# Altium schematic sheet reset.SchDoc
size A4
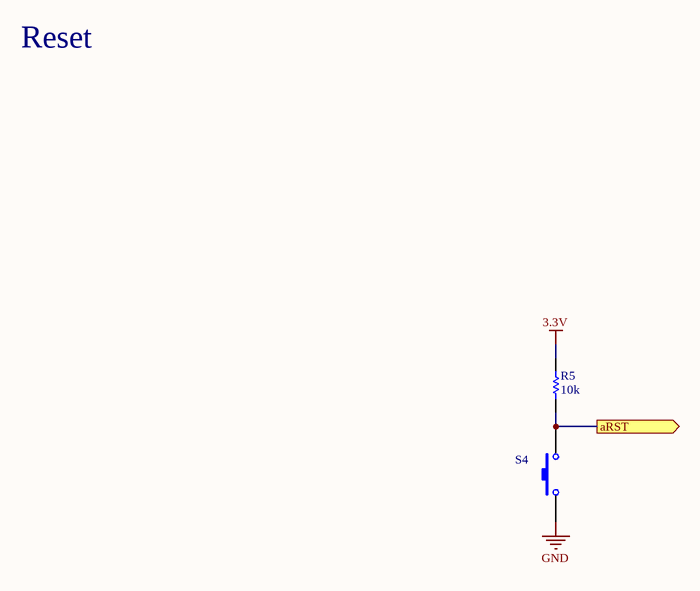
[diagram p0: reset.SchDoc]

## Parts
R5  10k  [AXIAL-0.3]
S4  Switch  [SPST-2]  (value not drawn)

## Ports
aRST (out)

## Nets
3.3V: R5.2
GND: S4.1
aRST: R5.1 S4.2 ; port aRST

## Notes on the sheet
- Reset

## Library data of the parts
R5 = Res1: Resistor; Published: 8-Jun-2000; LatestRevisionDate: 17-Jul-2002; LatestRevisionNote: Re-released for DXP Platform.; PackageReference: AXIAL-0.3; Publisher: Altium Limited; PackageDescription: Axial Device, Thru-Hole; 2 Leads; 0.3 in Pin Spacing
S4 = SW-PB: Reset; Published: 24-Mar-1999; LatestRevisionDate: 17-Jul-2002; LatestRevisionNote: Re-released for DXP Platform.; PackageReference: SPST-2; Publisher: Altium Limited; PackageDescription: Switch; 2 Leads